# EAGLE schematic FT232RL_only_pins (EAGLE 6.2)
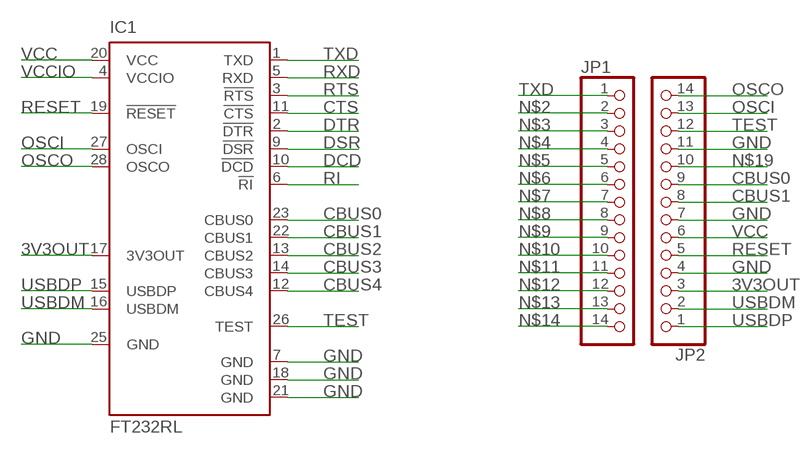
[diagram p0: schematic, sheet 1]

## Parts
IC1  FT232RL  [SSOP28]
JP1  PINHD-1X14  [1X14]
JP2  PINHD-1X14  [1X14]

## Nets
3V3OUT: IC1.17(3V3OUT) JP2.3
CBUS0: IC1.23(CBUS0) JP2.9
CBUS1: IC1.22(CBUS1) JP2.8
CBUS2: IC1.13(CBUS2)
CBUS3: IC1.14(CBUS3)
CBUS4: IC1.12(CBUS4)
CTS: IC1.11(!CTS)
DCD: IC1.10(!DCD)
DSR: IC1.9(!DSR)
DTR: IC1.2(!DTR)
GND: IC1.7(GND) IC1.18(GND) IC1.21(GND) IC1.25(GND) JP2.4 JP2.7 JP2.11
N$2: JP1.2
N$3: JP1.3
N$4: JP1.4
N$5: JP1.5
N$6: JP1.6
N$7: JP1.7
N$8: JP1.8
N$9: JP1.9
N$10: JP1.10
N$11: JP1.11
N$12: JP1.12
N$13: JP1.13
N$14: JP1.14
N$19: JP2.10
OSCI: IC1.27(OSCI) JP2.13
OSCO: IC1.28(OSCO) JP2.14
RESET: IC1.19(!RESET) JP2.5
RI: IC1.6(!RI)
RTS: IC1.3(!RTS)
RXD: IC1.5(RXD)
TEST: IC1.26(TEST) JP2.12
TXD: IC1.1(TXD) JP1.1
USBDM: IC1.16(USBDM) JP2.2
USBDP: IC1.15(USBDP) JP2.1
VCC: IC1.20(VCC) JP2.6
VCCIO: IC1.4(VCCIO)

## Library data of the parts
IC1 = ftdichip:FT232R: Source: http://www.ftdichip.com/Documents/DataSheets/DS_FT232R_v104.pdf; MPN: FT232RL; OC_FARNELL: 1146032; OC_NEWARK: 91K9918
JP1 JP2 = pinhead:PINHD-1X14: PIN HEADER